# EAGLE design nikon-photo-remote-pic16-mcu (EAGLE 9.2.1)
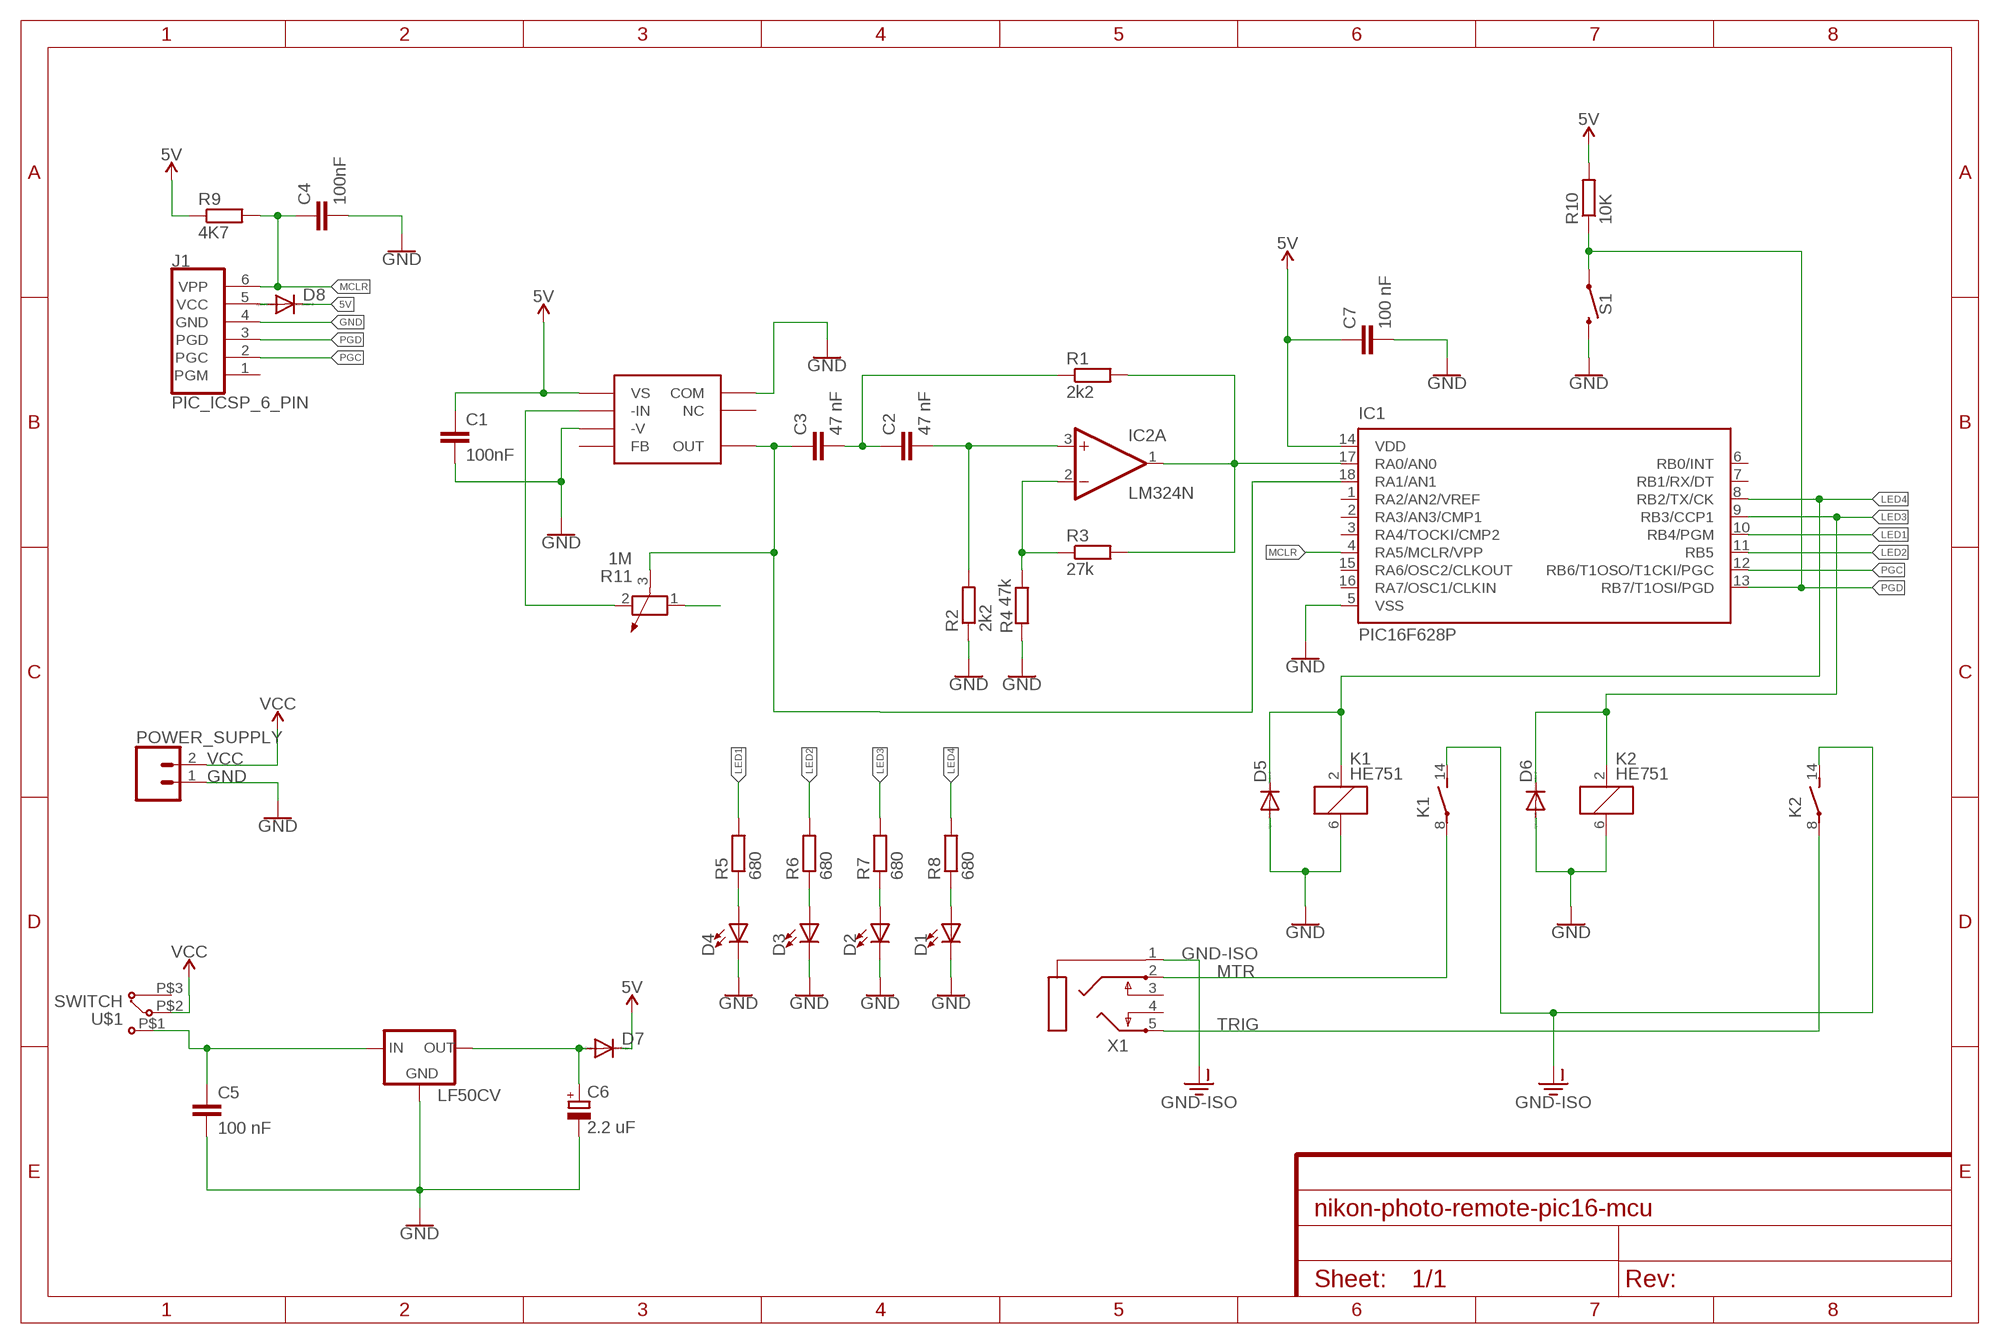
[diagram p0: schematic, sheet 1]

## Parts
C1  100nF  CAPACITOR_1025-024X044  [C025-024X044]
C2  47 nF  CAPACITOR_1025-024X044  [C025-024X044]
C3  47 nF  CAPACITOR_1025-024X044  [C025-024X044]
C4  100nF  CAPACITOR_1025-024X044  [C025-024X044]
C5  100 nF  CAPACITOR_1025-024X044  [C025-024X044]
C6  2.2 uF  CAPACITOR_POLARIZEDE2.5-6  [E2,5-6]
C7  100 nF  CAPACITOR_1025-024X044  [C025-024X044]
D1  LED5MM  [LED5MM_CLEAR]
D2  LED5MM  [LED5MM_CLEAR]
D3  LED5MM  [LED5MM_CLEAR]
D4  LED5MM  [LED5MM_CLEAR]
D5  DIODED-10  [D-10]
D6  DIODED-10  [D-10]
D7  DIODED-7.5  [D-7.5]
D8  DIODED-7.5  [D-7.5]
IC1  PIC16F628P  [DIL18]
IC2  LM324N  [DIL14]
J1  PIC_ICSP_6_PIN  [MOLEX-1X6]
K1  HE751  [HE751]
K2  HE751  [HE751]
LF50CV  V_REG_78XX_LAYING  [78XXL]
OPT101  OPT101  [DIL08]
POWER_SUPPLY  CONN_02  [1X02_S]
R1  2k2  RESISTOR0207/7  [0207/7]
R2  2k2  RESISTOR0207/7  [0207/7]
R3  27k  RESISTOR0207/7  [0207/7]
R4  47k  RESISTOR0207/7  [0207/7]
R5  680  RESISTOR0207/7  [0207/7]
R6  680  RESISTOR0207/7  [0207/7]
R7  680  RESISTOR0207/7  [0207/7]
R8  680  RESISTOR0207/7  [0207/7]
R9  4K7  RESISTOR0207/7  [0207/7]
R10  10K  RESISTOR0204/2V  [0204V]
R11  1M  POT  [POT_ALPHA_RV16AF-20]
S1  INPUT_MOMENTARY_SWITCH_SPST-PTH-6.0MM  [TACTILE_SWITCH_PTH_6.0MM]
U$1  SWITCH  [SWITCH]
X1  CONN_JACK_3.5MM_PG203J  [PG203J]

## Nets
5V: C1.1 C7.1 D7.C D8.C IC1.14(VDD) OPT101.1(VS) R9.1 R10.2
GND: C1.2 C4.2 C5.2 C6.- C7.2 D1.K(C) D2.K(C) D3.K(C) D4.K(C) D5.A D6.A IC1.5(VSS) J1.4(GND) K1.6 K2.6 LF50CV.GND OPT101.3(-V) OPT101.8(COM) POWER_SUPPLY.1 R2.1 R4.2 S1.3
GND-ISO: K1.14(2:S) K2.14(2:S) X1.1
LED1: IC1.10(RB4/PGM) R5.2
LED2: IC1.11(RB5) R6.2
LED3: D6.C IC1.9(RB3/CCP1) K2.2 R7.2
LED4: D5.C IC1.8(RB2/TX/CK) K1.2 R8.2
MCLR: C4.1 IC1.4(RA5/MCLR/VPP) J1.6(VPP) R9.2
MTR: K1.8(2:P) X1.2
N$1: C6.+ D7.A LF50CV.OUT
N$2: D8.A J1.5(VCC)
N$3: D4.A R5.1
N$4: D3.A R6.1
N$5: D2.A R7.1
N$6: D1.A R8.1
N$7: C5.1 LF50CV.IN U$1.P$1
N$8: IC1.17(RA0/AN0) IC2.1(A:OUT) R1.2 R3.2
N$9: IC2.2(A:-IN) R3.1 R4.1
N$10: C2.2 IC2.3(A:+IN) R2.2
N$11: C2.1 C3.2 R1.1
N$12: C3.1 IC1.18(RA1/AN1) OPT101.5(OUT) R11.3
N$13: R11.1
N$14: OPT101.2(-IN) R11.2
PGC: IC1.12(RB6/T1OSO/T1CKI/PGC) J1.2(PGC)
PGD: IC1.13(RB7/T1OSI/PGD) J1.3(PGD) R10.1 S1.1
TRIG: K2.8(2:P) X1.5
VCC: POWER_SUPPLY.2 U$1.P$2
Unconnected: IC1.1(RA2/AN2/VREF) IC1.2(RA3/AN3/CMP1) IC1.3(RA4/TOCKI/CMP2) IC1.6(RB0/INT) IC1.7(RB1/RX/DT) IC1.15(RA6/OSC2/CLKOUT) IC1.16(RA7/OSC1/CLKIN) IC2.5(B:+IN) IC2.6(B:-IN) IC2.7(B:OUT) IC2.8(C:OUT) IC2.9(C:-IN) IC2.10(C:+IN) IC2.12(D:+IN) IC2.13(D:-IN) IC2.14(D:OUT) J1.1(PGM) OPT101.4(FB) OPT101.6(NC) OPT101.7(NC) U$1.P$3 X1.3 X1.4

## Power pins joined to a net without a drawn wire
V+: IC2.4(P:V+)
V-: IC2.11(P:V-)

## Library data of the parts
C1-C5 C7 = 006-rcl:CAPACITOR_1: CAPACITOR, European symbol; SPICEPREFIX: C
C6 = 006-rcl:CAPACITOR_POLARIZED: POLARIZED CAPACITOR, European symbol; SPICEPREFIX: C
D1-D4 = 009-led:LED: LED OSRAM: - CHIPLED LG R971, LG N971, LY N971, LG Q971, LY Q971, LO R971, LY R971 LH N974, LH R974 LS Q976, LO Q976, LY Q976 LO Q996 - Hyper CHIPLED LW Q18S LB Q993, LB Q99A, LB R99A - SideLED LS A670, LO A670, LY A670, LG A670, LP A670 LB A673, LV A673, LT A673, LW A673 LH A674 LY A675 LS A676, LA A676, LO A676, LY A676, LW A676 LS A679, LY A679, LG A679 - Hyper Micro SIDELED® LS Y876, LA Y876, LO Y876, LY Y876 LT Y87S - SmartLED LW L88C, LW L88S LB L89C, LB L89S, LG L890 LS L89K, LO L89K, LY L89K LS L896, LA L896, LO L896, LY L896 - TOPLED LS T670, LO T670, LY T670, LG T670, LP T670 LSG T670, LSP T670, LSY T670, LOP T670, LYG T670 LG T671, LOG T671, LSG T671 LB T673, LV T673, LT T673, LW T673 LH T674 LS T676, LA T676, LO T676, LY T676, LB T676, LH T676, LSB T676, LW T676 LB T67C, LV T67C, LT T67C, LS T67K, LO T67K, LY T67K, LW E67C LS E67B, LA E67B, LO E67B, LY E67B, LB E67C, LV E67C, LT E67C LW T67C LS T679, LY T679, LG T679 LS T770, LO T770, LY T770, LG T770, LP T770 LB T773, LV T773, LT T773, LW T773 LH T774 LS E675, LA E675, LY E675, LS T675 LS T776, LA T776, LO T776, LY T776, LB T776 LHGB T686 LT T68C, LB T68C - Hyper Mini TOPLED® LB M676 - Mini TOPLED Santana® LG M470 LS M47K, LO M47K, LY M47K Source: http://www.osram.convergy.de LUXEON: - LUMILED® LXK2-PW12-R00, LXK2-PW12-S00, LXK2-PW14-U00, LXK2-PW14-V00 LXK2-PM12-R00, LXK2-PM12-S00, LXK2-PM14-U00 LXK2-PE12-Q00, LXK2-PE12-R00, LXK2-PE12-S00, LXK2-PE14-T00, LXK2-PE14-U00 LXK2-PB12-K00, LXK2-PB12-L00, LXK2-PB12-M00, LXK2-PB14-N00, LXK2-PB14-P00, LXK2-PB14-Q00 LXK2-PR12-L00, LXK2-PR12-M00, LXK2-PR14-Q00, LXK2-PR14-R00 LXK2-PD12-Q00, LXK2-PD12-R00, LXK2-PD12-S00 LXK2-PH12-R00, LXK2-PH12-S00 LXK2-PL12-P00, LXK2-PL12-Q00, LXK2-PL12-R00 Source: www.luxeon.com KINGBRIGHT: KA-3528ASYC Source: www.kingbright.com
D5-D8 = 13-diode:DIODE: DIODE
IC1 = microchip:PIC16F62*: FLASH-Based 8-Bit CMOS Microcontroller Source: http://ww1.microchip.com/downloads/en/DeviceDoc/40300C.pdf; MF: MICROCHIP; MPN: PIC16F628-04I/P; OC_FARNELL: 9760407; OC_NEWARK: 19C7272
IC2 = linear:LM324: OP AMP
J1 = SparkFun-Connectors:PIC_ICSP_6_PIN: ISCP Programming connector for PICs This 6 pin header contains all the lines necessary for programming most PIC microcontrollers. Here is the connector we sell at SparkFun: Polarized Connectors - Header (6-Pin) <https://www.sparkfun.com/products/8094> (PRT-08094) It is used on this SparkFun product: SparkFun UDB5 - PIC UAV Development Board <https://www.sparkfun.com/products/11703> (DEV-11703) Also, if you need a nice PIC programmer, please check these out: MPLAB PICkit 3 <https://www.sparkfun.com/products/9973> (PGM-09973); PROD_ID: CONN-08046; SF_ID: PRT-08094
K1 K2 = 001-private-inventory:HE751: RELAY reed, 1 x norm. open, Hamlin; OC_FARNELL: unknown; OC_NEWARK: unknown
LF50CV = 11-voltage-regulator:V_REG_78XX_LAYING: VOLTAGE REGULATOR
OPT101 = 000-private-todo-inventory:OPT101
POWER_SUPPLY = 007-connectors:CONN_02: Multi connection point. Often used as Generic Header-pin footprint for 0.1 inch spaced/style header connections On any of the 0.1 inch spaced packages, you can populate with these: Break Away Headers - Straight <https://www.sparkfun.com/products/116> (PRT-00116) Break Away Male Headers - Right Angle <https://www.sparkfun.com/products/553> (PRT-00553) Female Headers <https://www.sparkfun.com/products/115> (PRT-00115) Break Away Headers - Machine Pin <https://www.sparkfun.com/products/117> (PRT-00117) Break Away Female Headers - Swiss Machine Pin <https://www.sparkfun.com/products/743> (PRT-00743) For SCREWTERMINALS and SPRING TERMINALS visit here: Screw Terimnals on SparkFun.com <https://www.sparkfun.com/search/results?term=Screw+Terminals> (5mm/3.5mm/2.54mm spacing) This device is also useful as a general connection point to wire up your design to another part of your project. Our various solder wires solder well into these plated through hole pads. Hook-Up Wire - Assortment (Stranded, 22 AWG) <https://www.sparkfun.com/products/11375> (PRT-11375) Hook-Up Wire - Assortment (Solid Core, 22 AWG) <https://www.sparkfun.com/products/11367> (PRT-11367) View the entire wire category on our website here <https://www.sparkfun.com/categories/141> Special notes: Molex polarized connector foot print use with: PRT-08233 with associated crimp pins and housings. 2.54_SCREWTERM for use with PRT-10571. 3.5mm Screw Terminal footprints for PRT-08084 5mm Screw Terminal footprints for use with PRT-08432
R1-R10 = 006-rcl:RESISTOR: RESISTOR, European symbol; POWER: 0.25-0.6 W; SPICEPREFIX: R
R11 = 010-inputs:POT: Potentiometer
S1 = 010-inputs:INPUT_MOMENTARY_SWITCH_SPST: Momentary Switch (Pushbutton) - SPST Normally-open (NO) SPST momentary switches (buttons, pushbuttons). Variants PTH-12MM - 12mm square, through-hole Momentary Pushbutton Switch - 12mm Square <https://www.sparkfun.com/products/9190> (COM-09190) PTH-6.0MM, PTH-6.0MM-KIT - 6.0mm square, through-hole Mini Pushbutton Switch <https://www.sparkfun.com/products/97> (COM-00097) KIT package intended for soldering kit's - only one side of pads' copper is exposed. PTH-RIGHT-ANGLE-KIT - Right-angle, through-hole Right Angle Tactile Button <https://www.sparkfun.com/products/10791> - Used on SparkFun BigTime Watch Kit <https://www.sparkfun.com/products/11734> SMD-12MM - 12mm square, surface-mount Tactile Button - SMD (12mm) <https://www.sparkfun.com/products/12993> (COM-12993) Used on SparkFun PicoBoard <https://www.sparkfun.com/products/11888> SMD-4.5MM - 4.5mm Square Trackball Switch Used on SparkFun Blackberry Trackballer Breakout <https://www.sparkfun.com/products/13169> SMD-4.6MMX2.8MM - 4.60mm x 2.80mm, surface mount Used on SparkFun SAMD21 Mini Breakout <https://www.sparkfun.com/products/13664> SMD-5.2MM, SMD-5.2-REDUNDANT - 5.2mm square, surface-mount Mini Pushbutton Switch - SMD <https://www.sparkfun.com/products/8720> (COM-08720) Used on Arduino Pro Mini <https://www.sparkfun.com/products/11114> REDUNDANT package connects both switch circuits together SMD-6.0X3.5MM - 6.0 x 3.5mm, surface mount Momentary Reset Switch SMD <https://www.sparkfun.com/products/8229> (COM-08229) SMD-6.2MM-TALL - 6.2mm square, surface mount Tactile Button - SMD (6mm) <https://www.sparkfun.com/products/12992> Used on SparkFun Digital Sandbox <https://www.sparkfun.com/products/12651> SMD-RIGHT-ANGLE - Right-angle, surface mount Used on SparkFun Block for Intel® Edison - Arduino <https://www.sparkfun.com/products/13036>; PROD_ID: SWCH-08441; SF_SKU: COM-00097
U$1 = 010-inputs:SWITCH
X1 = 007-connectors:CONN_JACK_3.5MM_PG203J: MIC/HEADPHONE JACK KS-S stereo microphone/headphone jack PG203JN (Schukat); OC_FARNELL: unknown; OC_NEWARK: unknown

## Board
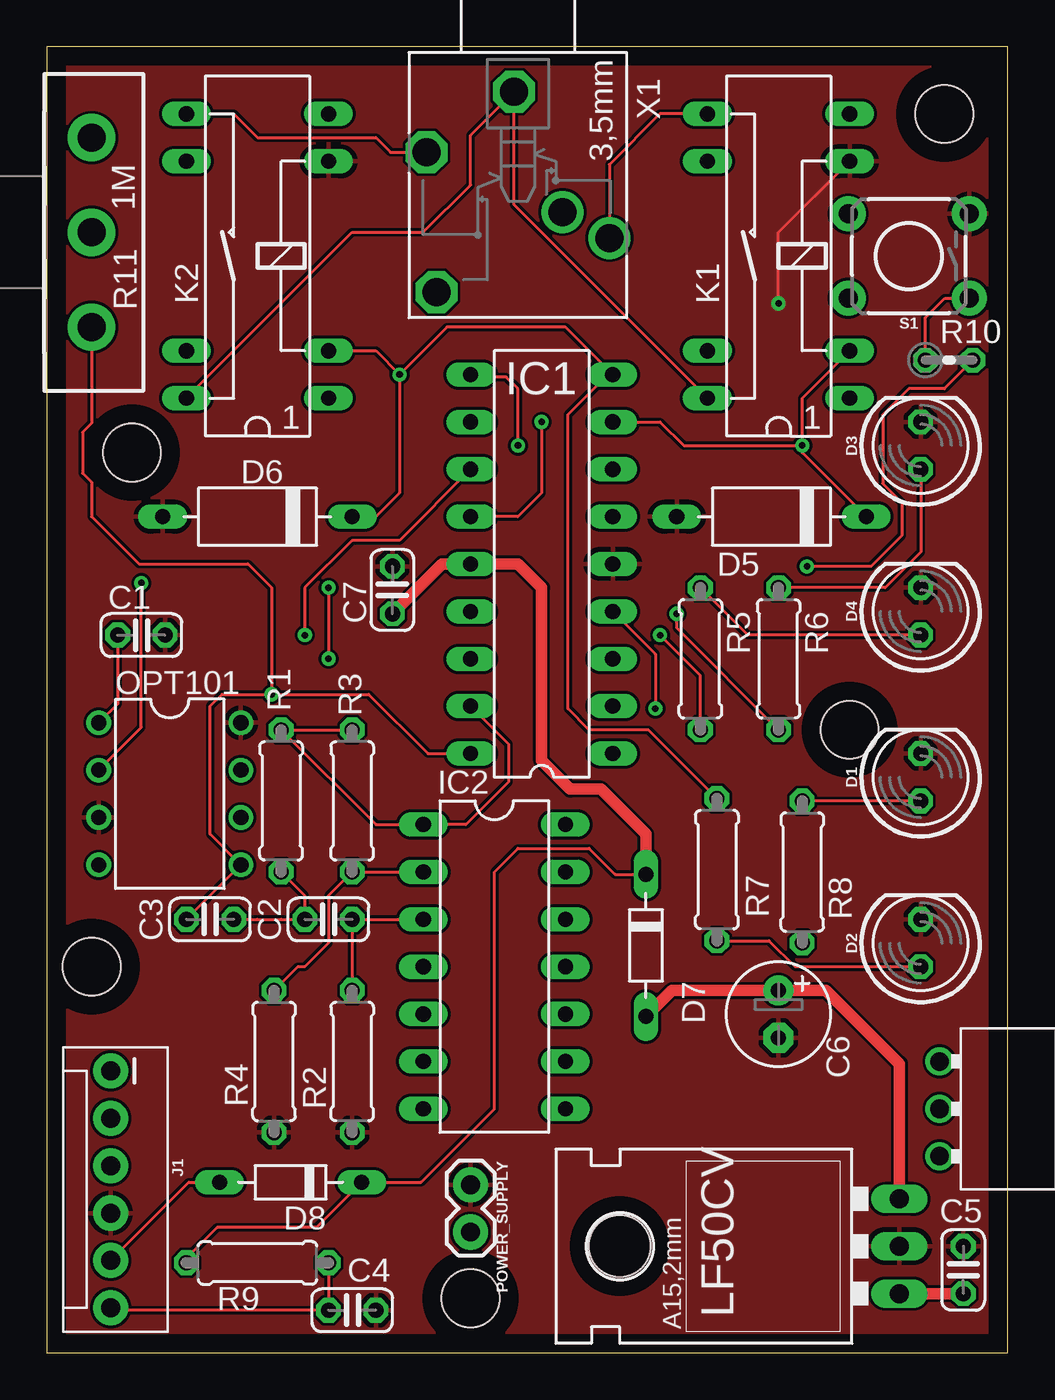
[diagram p1: board, top side]
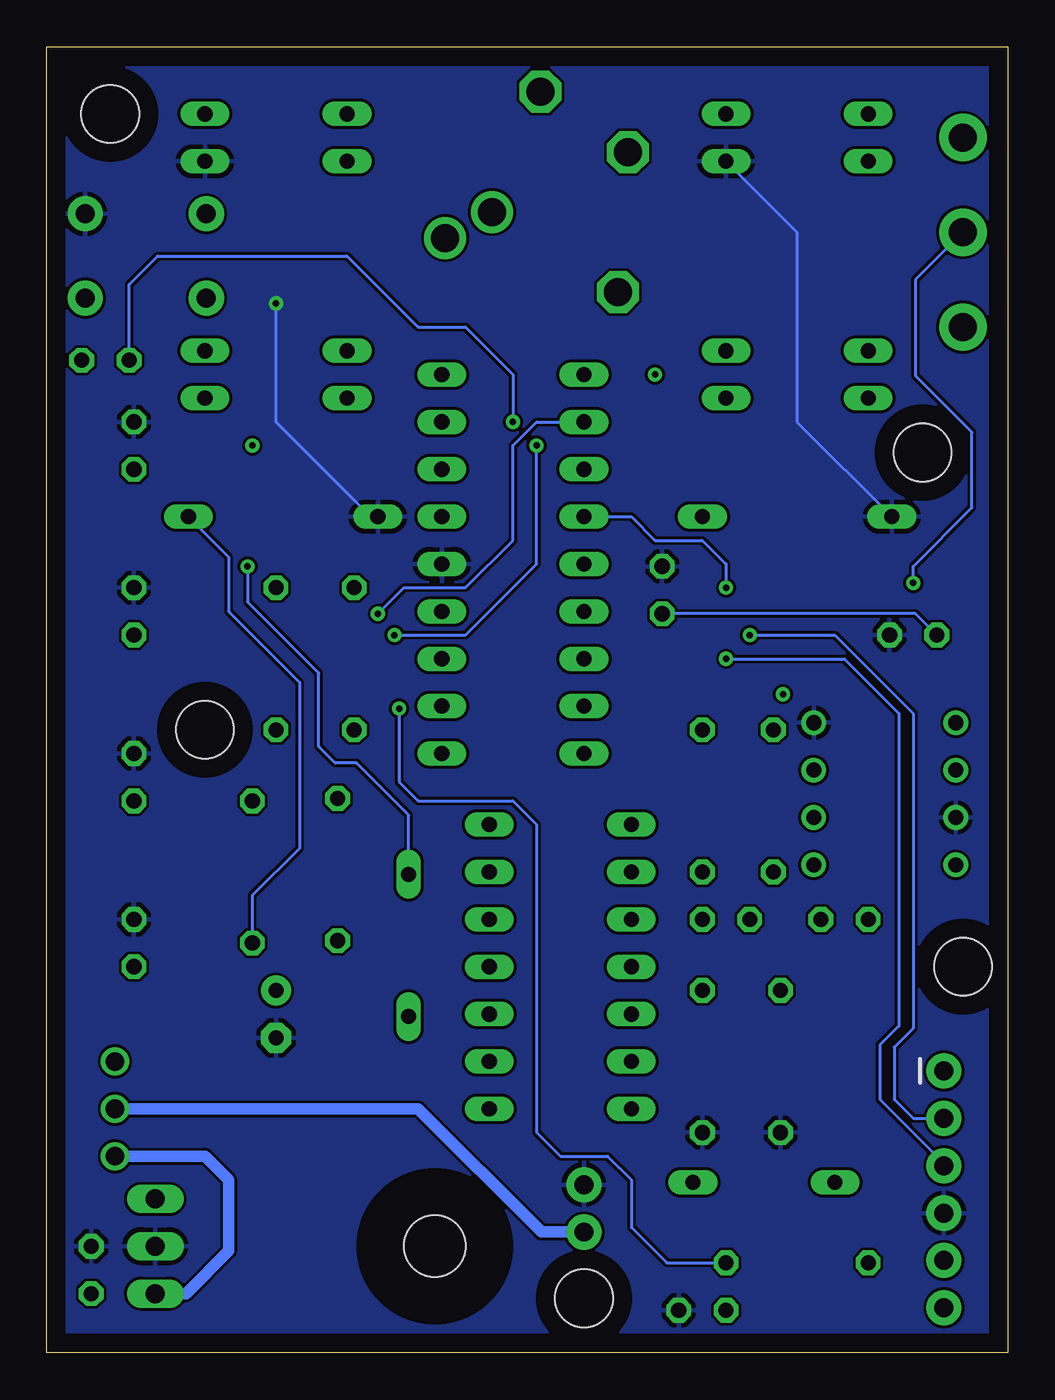
[diagram p2: board, bottom side, seen from below]

Size 51.54 x 70.03 mm. Coordinates in mm from the lower left corner, seen from the top.
Outline: 0,0 51.54,0 51.54,70.03 0,70.03 0,0
Copper layers (1*16): Top 0.035mm / dielectric 1.5mm / Bottom 0.035mm
Design rules "default": minimum track width 6mil, minimum drill 0.35mm, track to track 6mil, track to pad 6mil, pad to pad 6mil, via to via 6mil, smd to smd 6mil, copper to edge 40mil, drill to drill 6mil, minimum pad ring 10mil, minimum via ring 8mil, stop-mask expansion 4mil, vias tented up to drill 0mil, thermal gap 10mil
Holes 3.1 mm at 22.73,2.92 48.13,66.42 43.05,33.4 2.41,20.7 4.57,48.26

### Footprints (pad centres in the part's own frame; a part is rotated, then mirrored left to right if it is on the bottom)
C025-024X044 = drill 0.813 octagon: 1 -1.27,0; 2 1.27,0
E2,5-6 = drill 0.813 pad 1.6: + -1.27,0 | drill 0.813 pad 1.6 octagon: - 1.27,0
LED5MM_CLEAR = drill 0.813 octagon: A -1.27,0; K 1.27,0
D-10 = drill 0.813 long: A 5.08,0; C -5.08,0
D-7.5 = drill 0.813 long: A 3.81,0; C -3.81,0
DIL18 = drill 0.813 long: 1 -10.16,-3.81; 2 -7.62,-3.81; 3 -5.08,-3.81; 4 -2.54,-3.81; 5 0,-3.81; 6 2.54,-3.81; 7 5.08,-3.81; 8 7.62,-3.81; 9 10.16,-3.81; 10 10.16,3.81; 11 7.62,3.81; 12 5.08,3.81; 13 2.54,3.81; 14 0,3.81; 15 -2.54,3.81; 16 -5.08,3.81; 17 -7.62,3.81; 18 -10.16,3.81
DIL14 = drill 0.813 long: 1 -7.62,-3.81; 2 -5.08,-3.81; 3 -2.54,-3.81; 4 0,-3.81; 5 2.54,-3.81; 6 5.08,-3.81; 7 7.62,-3.81; 8 7.62,3.81; 9 5.08,3.81; 10 2.54,3.81; 11 0,3.81; 12 -2.54,3.81; 13 -5.08,3.81; 14 -7.62,3.81
MOLEX-1X6 = drill 1.016 pad 1.88: 1 0,0; 2 2.54,0; 3 5.08,0; 4 7.62,0; 5 10.16,0; 6 12.7,0
HE751 = drill 0.813 long: 1 -7.62,-3.81; 2 -5.08,-3.81; 6 5.08,-3.81; 7 7.62,-3.81; 8 7.62,3.81; 9 5.08,3.81; 13 -5.08,3.81; 14 -7.62,3.81
78XXL = drill 1.016 long: GND 0,-3.81; IN -2.54,-3.81; OUT 2.54,-3.81 | hole 3.302: 0,11.176
DIL08 = drill 0.813 pad 1.27: 1 -3.81,-3.81; 2 -1.27,-3.81; 3 1.27,-3.81; 4 3.81,-3.81; 5 3.81,3.81; 6 1.27,3.81; 7 -1.27,3.81; 8 -3.81,3.81
1X02_S = drill 1.016 pad 1.88: 1 0,0; 2 2.54,0
0207/7 = drill 0.813 octagon: 1 -3.81,0; 2 3.81,0
0204V = drill 0.813 octagon: 1 -1.27,0; 2 1.27,0
POT_ALPHA_RV16AF-20 = drill 1.5 pad 2.54: 1 -5.08,2.54; 2 0,2.54; 3 5.08,2.54
TACTILE_SWITCH_PTH_6.0MM = drill 1.016 pad 1.88: 1 -3.251,2.261; 2 3.251,2.261; 3 -3.251,-2.261; 4 3.251,-2.261
SWITCH = drill 1: P$1 -2.54,0; P$2 0,0; P$3 2.54,0
PG203J = drill 1.499 octagon: 1 -5.004,-0.203; 4 5.74,-4.369; 5 -1.753,-4.902 | drill 1.499: 2 2.845,4.902; 3 1.448,2.388

### Placement (x,y rotation side)
C1  5.08,38.48 0 top
C2  15.11,23.24 0 top
C3  8.76,23.24 0 top
C4  16.38,2.29 0 top
C5  49.15,4.44 90 top
C6  39.24,18.16 270 top
C7  18.54,40.89 90 top
D1  46.86,30.86 90 top
D2  46.86,21.97 90 top
D3  46.86,48.64 90 top
D4  46.86,39.75 90 top
D5  38.86,44.83 180 top
D6  11.3,44.83 180 top
D7  32.13,21.84 270 top
D8  13.08,9.14 180 top
IC1  26.54,42.29 90 top
IC2  24,20.7 270 top
J1  3.43,15.11 270 top
K1  39.24,58.8 90 top
K2  11.3,58.8 90 top
LF50CV  41.91,5.71 90 top
OPT101  6.6,29.97 270 top
POWER_SUPPLY  22.73,9.02 270 top
R1  12.57,29.59 90 top
R2  16.38,15.62 90 top
R3  16.38,29.59 90 top
R4  12.19,15.62 270 top
R5  35.05,37.21 270 top
R6  39.24,37.21 270 top
R7  35.94,25.91 90 top
R8  40.51,25.78 270 top
R9  11.3,4.83 0 top
R10  48.39,53.21 0 top
R11  -0.13,60.07 270 top
S1  46.23,58.8 180 top
U$1  47.88,13.08 90 top
X1  25.27,62.61 270 top

### Tracks (layer width: path | path; a pad name or v marks a point on that pad's centre or on a via)
5V  (via drill 0.35)
  Top 0.152: C1.1 3.81,34.8 OPT101.1 | R10.2 48.13,51.69 46.23,51.69 44.83,50.29 44.83,46.61 45.85,45.59 45.85,43.81 44.2,42.16 v40.77,42.16 | R9.1 7.37,4.95 9.14,6.73 14.48,6.73 D8.C 20.07,9.14 24,13.08 24,25.78 25.27,27.05 29.08,27.05 30.48,25.65 D7.C
  Top 0.61: C7.1 21.21,42.29 IC1.14 25.27,42.29 26.54,41.02 26.54,31.75 28.07,30.23 29.72,30.23 32.13,27.81 D7.C
  Bottom 0.152: C1.1 4.95,39.62 C7.1 | D7.C 32.13,28.83 34.93,31.62 36.07,31.62 36.96,32.51 36.96,36.45 40.77,40.26 v40.77,42.16
GND  (via drill 0.35)
  Top 0.152: v39.24,56.26 39.24,60.07 K1.6
  Bottom 0.152: K2.6 11.3,60.07 11.3,49.91 D6.A | 34.16,44.83 39.24,49.91 v39.24,56.26
  pour Top: 0,69.98 0,0.13 51.44,0.13 51.44,69.98
  pour Bottom: 0,69.98 51.44,69.98 51.44,0.13 0,0.13
GND-ISO
  Top 0.152: K1.14 25.07,61.54 X1.1 22.73,65.28 22.73,62.61 20.19,60.07 16.38,60.07 K2.14
LED1  (via drill 0.35)
  Top 0.152: R5.2 35.05,36.32 v32.89,38.48 | v25.27,48.64 25.27,51.69 24.64,52.32 22.86,52.32 IC1.10
  Bottom 0.152: v32.89,38.48 29.08,38.48 25.27,42.29 v25.27,48.64
LED2  (via drill 0.35)
  Top 0.152: R6.2 33.78,38.86 v33.78,39.62
  Bottom 0.152: v33.78,39.62 32.39,41.02 29.08,41.02 26.54,43.56 26.54,48.64 25.27,49.91 IC1.11
LED3  (via drill 0.35)
  Top 0.152: K2.2 17.65,53.72 v18.92,52.45 | D6.C 17.65,44.83 18.92,46.1 v18.92,52.45 | IC1.9 30.23,52.58 | 30.23,52.58 27.81,54.99 21.46,54.99 v18.92,52.45 | R7.2 32.26,33.4 29.08,33.4 27.94,34.54 27.94,50.29 30.23,52.58
LED4  (via drill 0.35)
  Top 0.152: K1.2 40.51,51.18 v40.51,48.64 | D5.C 40.51,48.26 v40.51,48.64 | IC1.8 32.89,49.91 34.16,48.64 v40.51,48.64
  Bottom 0.152: D5.C 41.78,42.67 41.78,39.75 37.97,35.94 37.97,27.05 40.51,24.51 R8.2
MCLR  (via drill 0.35)
  Top 0.152: R9.2 C4.1 3.56,2.29 J1.6 | IC1.4 32.64,37.46 v32.64,34.54
  Bottom 0.152: v32.64,34.54 32.64,30.61 31.62,29.59 26.54,29.59 25.27,28.32 25.27,11.81 24,10.54 21.46,10.54 20.19,9.27 20.19,6.73 18.29,4.83 R9.2
MTR
  Top 0.152: K1.8 32.89,66.42 30.18,63.7 X1.2
N$1
  Top 0.61: D7.A 33.53,19.43 C6.+ 41.78,19.43 45.72,15.49 LF50CV.OUT
N$2
  Top 0.152: J1.5 7.62,9.14 D8.A
N$3
  Top 0.152: R5.1 37.59,38.48 D4.A
N$4
  Top 0.152: D3.A 46.86,42.93 44.96,41.02 R6.1
N$5
  Top 0.152: R7.1 38.73,22.1 40.13,20.7 D2.A
N$6
  Top 0.152: D1.A R8.1
N$7
  Top 0.61: C5.1 LF50CV.IN
  Bottom 0.61: LF50CV.IN 44.07,3.18 41.78,5.46 41.78,9.27 43.05,10.54 U$1.P$1
N$8
  Top 0.152: IC1.17 24.77,32.64 24.77,30.61 22.48,28.32 IC2.1 17.65,28.32 R1.2 R3.2
N$9
  Top 0.152: R4.1 13.46,20.7 13.84,20.7 15.11,21.97 15.11,24.51 R3.1 IC2.2
N$10
  Top 0.152: IC2.3 C2.2 R2.2
N$11
  Top 0.152: C3.2 11.3,23.24 12.57,23.24 C2.1 13.84,24.51 R1.1
N$12  (via drill 0.35)
  Top 0.152: v12.07,35.31 17.27,35.31 20.45,32.13 IC1.18 | v12.07,35.31 12.07,41.02 10.8,42.29 4.95,42.29 2.41,44.83 2.41,46.68 1.93,47.17 1.93,49.35 2.41,49.84 R11.3 | C3.1 OPT101.5 8.76,27.81 8.76,34.67 9.4,35.31 v12.07,35.31
N$14  (via drill 0.35)
  Top 0.152: OPT101.2 5.08,33.53 5.08,40.64 v5.08,41.27
  Bottom 0.152: v5.08,41.27 5.08,42.16 1.93,45.31 1.93,49.35 4.95,52.38 4.95,57.53 R11.2
PGC  (via drill 0.35)
  Top 0.152: IC1.12 18.92,43.56 16.38,43.56 13.84,41.02 v13.84,38.48
  Bottom 0.152: v13.84,38.48 9.27,38.48 5.08,34.29 5.08,17.4 6.1,16.38 6.1,13.59 5.08,12.57 J1.2
PGD  (via drill 0.35)
  Top 0.152: v26.54,49.91 26.54,46.1 25.27,44.83 IC1.13 | v15.11,41.02 v15.11,37.21 | R10.1 47.12,55.5 48.16,56.54 S1.1
  Bottom 0.152: R10.1 47.12,57.28 45.59,58.8 35.43,58.8 31.62,54.99 29.08,54.99 26.54,52.45 v26.54,49.91 | IC1.13 20.19,44.83 18.92,43.56 16.38,43.56 15.11,42.29 v15.11,41.02 | v15.11,37.21 8.76,37.21 5.84,34.29 5.84,17.53 6.86,16.51 6.86,13.59 3.43,10.16 J1.3
TRIG
  Top 0.152: K2.8 10.03,66.42 11.3,65.15 17.65,65.15 18.44,64.36 X1.5
VCC
  Bottom 0.61: POWER_SUPPLY.2 25.02,6.48 31.62,13.08 U$1.P$2

### Text on the board
Document: 9V battery